# Altium schematic sheet tx.SchDoc: Transmit Path
size Letter; Organization: PulseOut COVID; Address1: By: N. Petrunyak; Address2: pulseoutcovid.com; DocumentNumber: 0; Revision: 0; SheetNumber: 3; SheetTotal: 5
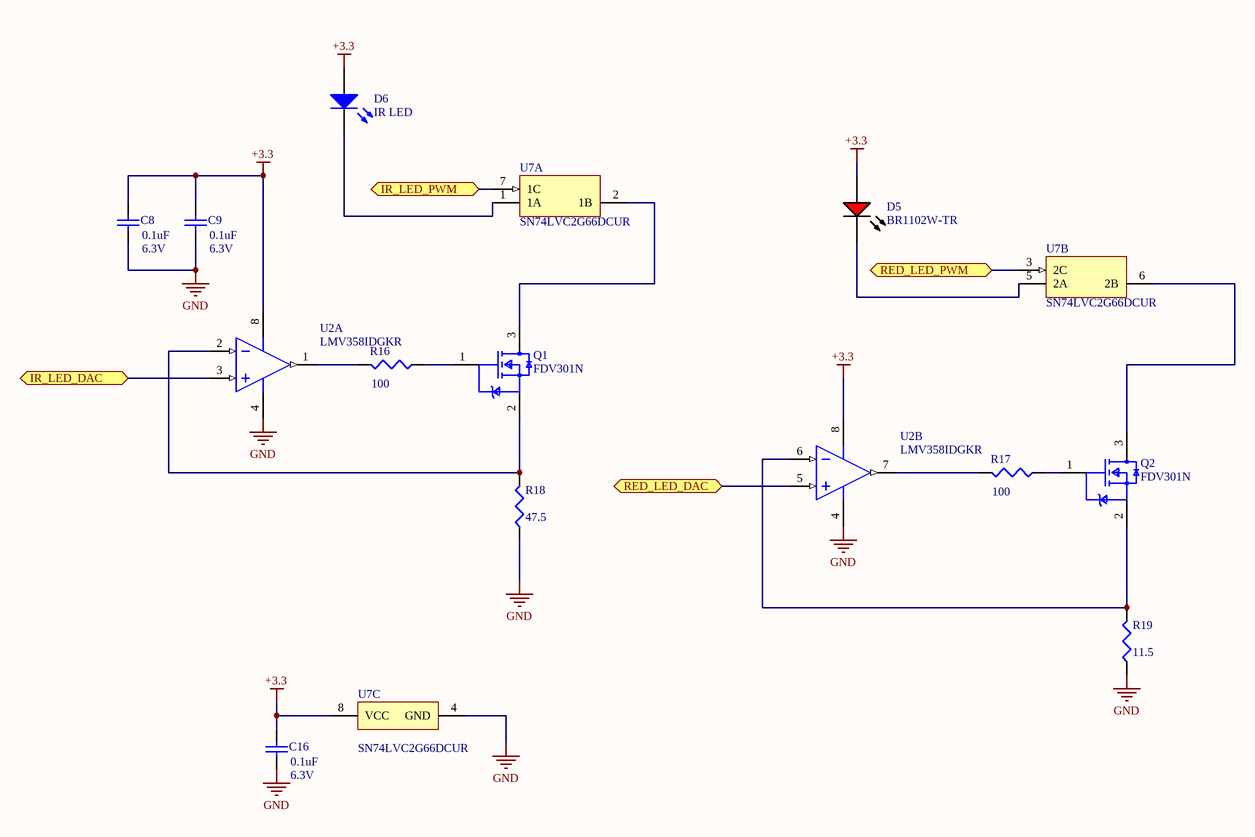
[diagram p0: tx.SchDoc]

## Parts
C8  value 0.1uF  Voltage: 6.3V  [1608[0603]]  (hidden comment: Cap Semi)
C9  value 0.1uF  Voltage: 6.3V  [1608[0603]]  (hidden comment: Cap Semi)
C16  value 0.1uF  Voltage: 6.3V  [1608[0603]]  (hidden comment: Cap Semi)
D5  BR1102W-TR  [STEC-1102W_V]
D6  IR LED  [1206_180]
Q1  FDV301N  [FP-318-08-MFG]
Q2  FDV301N  [FP-318-08-MFG]
R16  value 100  [J1-0603]  (hidden comment: Res3)
R17  value 100  [J1-0603]  (hidden comment: Res3)
R18  47.5  [J1-0603]
R19  11.5  [J1-0603]
U2  LMV358IDGKR  [DGK0008A_M]  (parts A,B of 2)
U7  SN74LVC2G66DCUR  [DCU0008A_M]  (parts A,B,C of 3)

## Ports
IR_LED_DAC (bidir), IR_LED_PWM (bidir), RED_LED_DAC (bidir), RED_LED_PWM (bidir)

## Nets
+3.3: C8.2 C9.2 C16.2 D5.1(A) D6.1(A) U2.8(VCC+) U7.8(VCC)
GND: C8.1 C9.1 C16.1 R18.1 R19.1 U2.4(GND) U7.4(GND)
IR_LED_DAC: U2.3(1IN+) ; port IR_LED_DAC
IR_LED_PWM: U7.7(1C) ; port IR_LED_PWM
RED_LED_DAC: U2.5(2IN+) ; port RED_LED_DAC
RED_LED_PWM: U7.3(2C) ; port RED_LED_PWM
NetD5_2: D5.2(K) U7.5(2A)
NetD6_2: D6.2(K) U7.1(1A)
NetQ1_1: Q1.1(G) R16.1
NetQ1_2: Q1.2(S) R18.2 U2.2(1IN-)
NetQ1_3: Q1.3(D) U7.2(1B)
NetQ2_1: Q2.1(G) R17.1
NetQ2_2: Q2.2(S) R19.2 U2.6(2IN-)
NetQ2_3: Q2.3(D) U7.6(2B)
NetR16_2: R16.2 U2.1(1OUT)
NetR17_2: R17.2 U2.7(2OUT)

## Notes on the sheet
- Title
- Size:
- Date:
- Letter
- Number:
- Time:
- Revision:
- Sheet
- of
- File:

## Library data of the parts
C8 C9 C16 = Cap Semi: Capacitor (Semiconductor SIM Model); MPN: 06036C104KAT4A; Manufacturer: AVX Corporation; Published: 8-Jun-2000; LatestRevisionDate: 29-May-2009; LatestRevisionNote: IPC-7351 Footprint Added.; PackageReference: C1206; Publisher: Altium Limited; PackageDescription: Chip Capacitor; DigiKey: 478-06036C104KAT4ACT-ND
D5 = CMP-2000-05961-1: LED, Red, 647 nm, -30 to 85 degC, 2-Pin SMD, RoHS, Tape and Reel; Manufacturer: Stanley Electric; Rad Hardened: No; Number of  Elements: 1; Dominant Wave Length: 647nm; DELETED: Compliant; Product Depth (mm): 1.5mm; Chip Material: GaAlAs; Product Length (mm): 3mm; Power Dissipation: 60W; Peak Wavelength: 660nm; Luminous Intensity: 33.6mcd; Forward Current: 30mA; Forward Voltage: 2V; Viewing Angle: 70/82deg; Main Category: ChipLED; Test Current (It): 20mA; Reverse Voltage: 4V; Type: Uni-Color; Shape Type: Rectangular; Package Description: 2-Pin Surface Mounted Device , Body 3 x 1.5 mm; Pin Count: 2; Datasheet Version: 08/2007; Lens Dimensions: 2x1.5x0.9mm; Mounting Technology: SurfaceMount; Packaging: TapeandReel; Operating Temp Range: -30Cto85C; Product Height (mm): 1.5mm; Package Type: SMD; Emitting Color: Red; Datasheet URL: https://datasheet.ciiva.com/34302/1845603-34302809.pdf; Operating Temperature Classification: Commercial; Lum Intensity: 33.6mcd; Mounting: SurfaceMount; Manufacturer URL: http://www.stanley-electric.com/; High Brightness: No; Package Reference: 1102W; DigiKey: 404-1048-1-ND; MPN: BR1102W-TR
D6 = LED0: Typical INFRARED GaAs LED; MPN: IR26-21C/L110/TR8; Manufacturer: Everlight Electronics Co Ltd; Published: 8-Jun-2000; LatestRevisionDate: 08-Jul-2005; LatestRevisionNote: Mech Layer 1 removed.; PackageReference: LED-0; Publisher: Altium Limited; PackageDescription: LED; 2 Leads; DigiKey: 1080-1357-1-ND
Q1 Q2 = CMP-07173-000062-1: MOSFET N-CH 25V 220MA SOT-23; Manufacturer: ON Semiconductor; Turn Off Delay Time: 3.5ns; Typ Forward Diode Voltage: 0.8V; Max Junction Temp: +150°C; Threshold Vgs Max: 1.06V; Threshold Vgs Min: 0.7V; Standoff Height: 0.01mm; Max Forward Diode Voltage: 1.2V; Number Of Channels: 1; Rthja Max: 357°C/W; Drain To Source Resistance: 3.1Ω; Input Capacitace At Vds: 9.5pF @ 10V; Gate Charge At Vgs: 0.49nC @ 4.5V; Transconductance: 0.2S; Turn On Delay Time: 3.2ns; Depletion Mode: False; Power Dissipation: 0.35W; Continuous Drain Current: 0.22A; Gate To Source Voltage: 8V; RoHS: TRUE; Lead Free: Yes; Temperature Range High: +150°C; Automotive: No; Height: 1.11mm; Category: Trans; Mouser Description: MOSFET N-Ch Digital; Drain To Source Voltage: 25V; Temperature: -55°C to +150°C; Ipc Land Pattern Name: SOT95P240X100-3; Device Class L1: Discrete Semiconductors; Octopart: https://octopart.com/fdv301n-on+semiconductor-84326713; Footprint Url: https://www.onsemi.com/pub/Collateral/318-08.PDF; Digikey Description: MOSFET N-CH 25V 220MA SOT-23; Drain To Source Breakdown Voltage: 25V; Temperature Range Low: -55°C; Number Of N Channels: 1; Device Class L3: MOSFETs; Package: 318-08; ComponentLink2URL: https://www.onsemi.com/pub/Collateral/FDV301N-D.PDF; Manufacturer Part Number: FDV301N; Device Class L2: Transistors; ComponentLink2Description: Datasheet; DigiKey: FDV301NCT-ND; MPN: FDV301N
R16 R17 = Res3: Resistor; MPN: ERJ-PA3F1000V; Manufacturer: Panasonic; Published: 8-Jun-2000; LatestRevisionDate: 29-May-2009; LatestRevisionNote: IPC-7351 Footprint Added.; PackageReference: J1-0603; Publisher: Altium Limited; PackageDescription: Chip Resistor; DigiKey: P100BYCT-ND
R18 = Res3: Resistor; MPN: RC0603FR-0747R5L; Manufacturer: Yageo; Published: 8-Jun-2000; LatestRevisionDate: 29-May-2009; LatestRevisionNote: IPC-7351 Footprint Added.; PackageReference: J1-0603; Publisher: Altium Limited; PackageDescription: Chip Resistor; Value: 47.5; DigiKey: 311-47.5HRDKR-ND
R19 = Res3: Resistor; MPN: ERJ-3EKF11R5V; Manufacturer: Panasonic; Published: 8-Jun-2000; LatestRevisionDate: 29-May-2009; LatestRevisionNote: IPC-7351 Footprint Added.; PackageReference: J1-0603; Publisher: Altium Limited; PackageDescription: Chip Resistor; Value: 11.5; DigiKey: P11.5HCT-ND
U2 = CMP-2100-03651-1: Low-Voltage Rail-to-Rail Output Operational Amplifier, 2.7 to 5.5 V, -40 to 125 degC, 8-Pin VSSOP (DGK), Green (RoHS & no Sb/Br), Tape and Reel; Manufacturer: Texas Instruments; MPN: LMV358SG-13; Unity Gain Bandwidth Product: 1MHz; Common Mode Rejection Ratio: 50dB; Operating Supply Current: 210uA; Number of Circuits: 2; Input Offset Voltage (Vos): 7mV; Voltage Gain: 100dB; Supply Voltage: 5V; Nominal Supply Current: 440uA; Input Bias Current: 250nA; Min Supply Voltage: 2.7V; Max Supply Voltage: 5.5V; Slew Rate: 1V/us; Output Current per Channel: 160mA; Width: 3mm; Package Description: 8-Pin Thin Small Outline Package, Body 3 x 3 mm, Pitch 0.65 mm; Packaging: TapeandReel; REACH SVHC: NoSVHC; Number of Pins: 8; Length: 3mm; Lead Free: LeadFree; Height: 0.97mm; Package URL: http://www.ti.com/litv/pdf/mpds028d; Number of Channels: 2; Number of Elements: 2; Datasheet URL: http://www.ti.com/lit/ds/symlink/lmv358.pdf; Datasheet Version: SLOS263W, 10/2014; Case/Package: MSOP; Bandwidth: 1MHz; Gain Bandwidth Product: 1MHz; Number of Amplifiers: 2; Max Operating Temperature: 85degC; Mount: SurfaceMount; RoHSCompliant: true; Package Reference: DGK0008A; Min Operating Temperature: -40degC; Radiation Hardening: No; Contact Plating: Gold; Package Quantity: 1; Output Current: 160mA; Manufacturer URL: http://www.ti.com/; DigiKey: LMV358SG-13DICT-ND
U7 = CMP-0859-00645-3: Dual Analog Switch, DCU0008A, LARGE T&R; Manufacturer: Texas Instruments; 3-State Output: No; Rating: Catalog; Output Drive (IOL/IOH)(Max)(mA): 32/-32; Bits(#): 2; Output Type: CMOS; ICC @ Nom Voltage(Max)(mA): 0.01; Voltage(Nom)(V): 1.8,2.5,3.3,5; tpd @ Nom Voltage(Max)(ns): 2,1.2,0.8,0.6; Logic: True; VCC(Min)(V): 1.65; Technology Family: LVC; F @ Nom Voltage(Max)(Mhz): 150; Switch Configuration: SPST; VCC(Max)(V): 5.5; Sub-Family: Analog Switch; DatasheetVersion: SCES325K; Generic Part Number: SN74LVC2G66; PackageReference: DCU0008A; Channels(#): 2; Input Type: CMOS; Schmitt Trigger: No; Operating Temperature Range(C): -40 to 85; DigiKey: 296-13272-1-ND; MPN: SN74LVC2G66DCUR